# Altium schematic sheet STM32F070CBT6.SchDoc
size A; SheetNumber: 8; SheetTotal: 8
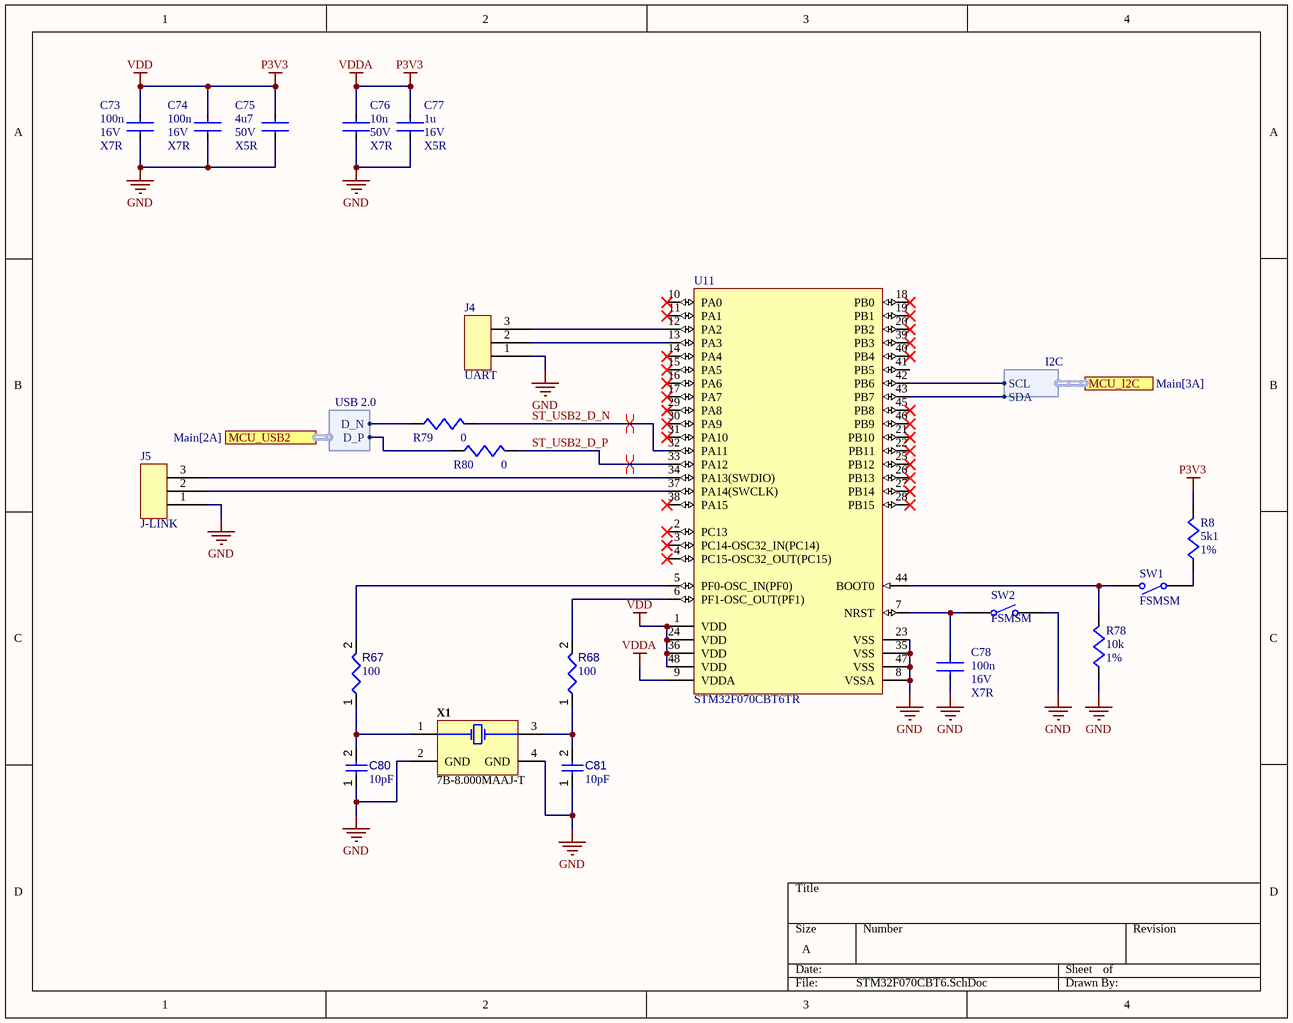
[diagram p0: STM32F070CBT6.SchDoc]

## Parts
C73  value 100n  Voltage: 16V  Dielectric: X7R  [CAPC1005X06N]  (hidden comment: 100nF 16V 0402)
C74  value 100n  Voltage: 16V  Dielectric: X7R  [CAPC1005X06N]  (hidden comment: 100nF 16V 0402)
C75  value 4u7  Voltage: 50V  Dielectric: X5R  [CAPC2012X14N]  (hidden comment: 4.7uF 50V 0805)
C76  value 10n  Voltage: 50V  Dielectric: X7R  [CAPC1608X08N]  (hidden comment: 10n 50V X7R 0603)
C77  value 1u  Voltage: 16V  Dielectric: X5R  [CAPC1005X06N]  (hidden comment: 1uF 16V X5R 0402)
C78  value 100n  Voltage: 16V  Dielectric: X7R  [CAPC1005X06N]  (hidden comment: 100nF 16V 0402)
C80  value 10pF  [CAPC1005X55X25ML05T05]  (hidden comment: Capacitor 10 pF +/- 5% 50 V 0402)
C81  value 10pF  [CAPC1005X55X25ML05T05]  (hidden comment: Capacitor 10 pF +/- 5% 50 V 0402)
J4  UART  [3x0.1" Header-Footprint-1]
J5  J-LINK  [3x0.1" Header-Footprint-1]
R8  value 5k1  Tolerance: 1%  [RESC1508X05M]  (hidden comment: 5k1 1% 0603)
R67  value 100  [RESC0402(1005)_L]  (hidden comment: 100R2F)
R68  value 100  [RESC0402(1005)_L]  (hidden comment: 100R2F)
R78  value 10k  Tolerance: 1%  [RESC1005X04M]  (hidden comment: 10k 1% 0402)
R79  value 0  [RESC1508X05M]  (hidden comment: 0 Ohm 1% 0603)
R80  value 0  [RESC1508X05M]  (hidden comment: 0 Ohm 1% 0603)
SW1  FSMSM  [TECO-FSMSM-2_V]
SW2  FSMSM  [TECO-FSMSM-2_V]
U11  STM32F070CBT6TR  [STM-LQFP48_N]
X1  7B-8.000MAAJ-T  [TXC-7B-4_V]

## Ports
MCU_I2C (harness I2C, see Main[3A]), MCU_USB2 (harness USB 2.0, see Main[2A])

## Harnesses
USB 2.0: D_P, D_N
I2C: SCL, SDA

## Nets
GND: C73.2 C74.2 C75.2 C76.2 C77.2 C78.1 C80.1 C81.1 J4.1 J5.1 R78.1 SW2.2 U11.8(VSSA) U11.23(VSS) U11.35(VSS) U11.47(VSS) X1.2(GND) X1.4(GND)
P3V3: C73.1 C74.1 C75.1 C76.1 C77.1 R8.2 U11.1(VDD) U11.9(VDDA) U11.24(VDD) U11.36(VDD) U11.48(VDD)  [also labelled VDD, VDDA]
ST_USB2_D_N: R79.2 U11.32(PA11)
ST_USB2_D_P: R80.2 U11.33(PA12)
NetC78_2: C78.2 SW2.1 U11.7(NRST)
NetC80_2: C80.2 R67.1 X1.1(X1)
NetC81_2: C81.2 R68.1 X1.3(X2)
NetJ4_2: J4.2 U11.13(PA3)
NetJ4_3: J4.3 U11.12(PA2)
NetJ5_2: J5.2 U11.37(PA14(SWCLK))
NetJ5_3: J5.3 U11.34(PA13(SWDIO))
NetR8_1: R8.1 SW1.1
NetR67_2: R67.2 U11.5(PF0-OSC_IN(PF0))
NetR68_2: R68.2 U11.6(PF1-OSC_OUT(PF1))
NetR78_2: R78.2 SW1.2 U11.44(BOOT0)
NetR79_1: R79.1 ; port MCU_USB2.D_N
NetR80_1: R80.1 ; port MCU_USB2.D_P
NetU11_42: U11.42(PB6) ; port MCU_I2C.SCL
NetU11_43: U11.43(PB7) ; port MCU_I2C.SDA

Not connected (* = marked no-connect by the designer): U11 2(PC13)* 3(PC14-OSC32_IN(PC14))* 4(PC15-OSC32_OUT(PC15))* 10(PA0)* 11(PA1)* 14(PA4)* 15(PA5)* 16(PA6)* 17(PA7)* 18(PB0)* 19(PB1)* 20(PB2)* 21(PB10)* 22(PB11)* 25(PB12)* 26(PB13)* 27(PB14)* 28(PB15)* 29(PA8)* 30(PA9)* 31(PA10)* 38(PA15)* 39(PB3)* 40(PB4)* 41(PB5) 45(PB8)* 46(PB9)*

## Layout directives
differential pair: ST_USB2_D_N, ST_USB2_D_P

## Library data of the parts
C73 C74 C78 = CMP-001-00088-1: 16V 100nF X7R ±10% 0402 Multilayer Ceramic Capacitors MLCC - SMD/SMT ROHS; LCSC Part #: C1525; Package: 0402
C75 = CMP-001-00089-1: 50V 4.7uF X5R ±10% 0805 Multilayer Ceramic Capacitors MLCC - SMD/SMT ROHS; LCSC Part #: C98192; Package: 0805
C76 = CMP-001-00106-1: 50V 10nF X7R ±10% 0603 Multilayer Ceramic Capacitors MLCC - SMD/SMT ROHS; LCSC Part #: C100042; Package: 0603
C77 = CMP-001-00098-1: 16V 1uF X5R ±10% 0402 Multilayer Ceramic Capacitors MLCC - SMD/SMT ROHS; LCSC Part #: C29266; Package: 0402
C80 C81 = CMP-001-00013-6: Chip Capacitor, 10 pF, +/- 5%, 50 V, 0402 (1005 Metric); Capacitor Type: Ceramic; Voltage Rating: 50V; Max Operating Temperature: 125°C; Pins: 2; Mounting Technology: SM; Tolerance: 5%; RoHS Compliant: True; Case/Package: 0402; Min Operating Temperature: -55°C
J4 J5 = CMP-002-00078-3: 3x0.1" pitch header
R8 = CMP-009-00204-2: 100mW Thick Film Resistors 75V ±100ppm/℃ ±1% 5.1kΩ 0603 Chip Resistor - Surface Mount ROHS; LCSC Part #: C105580; Package: 0603
R67 R68 = CMP-009-00065-2: 100R 0.063W 1% 0402 (1005 Metric)  SMD; Power: 63mW; Tolerance: 1%; Case/Package: 0402; Pins: 2; Mounting Technology: SMT
R78 = CMP-009-00187-2: 62.5mW Thick Film Resistors 50V ±100ppm/℃ ±1% 10kΩ 0402 Chip Resistor - Surface Mount ROHS; Package: 0402; LCSC Part #: C60490
R79 R80 = CMP-009-00190-2: 62.5mW Thick Film Resistors 50V 0Ω 0402 Chip Resistor - Surface Mount ROHS; Tolerance: 1%; Package: 0603; LCSC Part #: C60485
SW1 SW2 = CMP-011-00013-1: Switch Tactile OFF (ON) SPST Rectangular Button Gull Wing 0.05A 12VDC SMD Loose Piece
U11 = CMP-020-00035-1: Mainstream ARM Cortex-M0 Value line MCU with 128 Kbytes Flash, 48 MHz CPU, USB
X1 = CMP-003-00013-2: SMD Seam Sealing Crystal, 8 MHz, +/- 30 ppm, 18 pF, -10 to 70 degC, 4-Pin SMD, RoHS, Tape and Reel; Manufacturer: TXC; Frequency: 8MHz; Resistance: 100Ohm; Tolerance: 30ppm; Load Capacitance: 18pF; ESR: 100; Package Quantity: 1000; Datasheet URL: http://www.txccorp.com/download/products/quartz_crystals/2015TXC_7B_19.pdf; Case/Package: 7B-4; Packaging: TapeandReel; Frequency Tolerance: 30ppm; Min Operating Temperature: -20°C; RoHS Compliant: True; Package Reference: 7B-4; Mounting Technology: SM; Datasheet Version: Jul-15; Max Operating Temperature: 70°C; Package Description: 4-Pin Surface Mount Device, Body 5 x 3.2 mm, Pitch 3.7 mm; Pins: 4